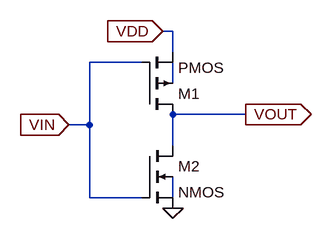
[diagram p0: schematic NOT.asc]
NOT.asc, the LTspice schematic file:
Version 4
SHEET 1 880 680
WIRE 208 16 192 16
WIRE 208 48 208 16
WIRE 160 64 80 64
WIRE 208 96 208 64
WIRE 320 144 208 144
WIRE 80 160 80 64
WIRE 80 160 48 160
WIRE 208 192 208 144
WIRE 80 272 80 160
WIRE 160 272 80 272
WIRE 208 272 208 240
FLAG 48 160 VIN
IOPIN 48 160 In
FLAG 320 144 VOUT
IOPIN 320 144 Out
FLAG 192 16 VDD
IOPIN 192 16 In
FLAG 208 288 0
SYMBOL pmos4 160 144 M180
SYMATTR InstName M1
SYMATTR Value2 l=90n w=400n
SYMBOL nmos4 160 192 R0
SYMATTR InstName M2
SYMATTR Value2 l=90n w=200n

The netlist it stands for:
* NOT.asc
M1 VOUT VIN VDD N001 PMOS l=90n w=400n
M2 VOUT VIN 0 N002 NMOS l=90n w=200n
.model NMOS NMOS
.model PMOS PMOS
.lib standard.mos
.backanno
.end